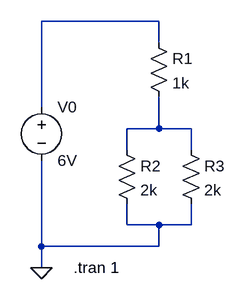
[diagram p0: schematic example_to_explain_V_and_I_measurements.asc]
example_to_explain_V_and_I_measurements.asc, the LTspice schematic file:
Version 4
SHEET 1 880 680
WIRE 432 48 256 48
WIRE 432 80 432 48
WIRE 256 176 256 48
WIRE 432 208 432 160
WIRE 432 208 384 208
WIRE 480 208 432 208
WIRE 384 240 384 208
WIRE 480 240 480 208
WIRE 384 352 384 320
WIRE 432 352 384 352
WIRE 480 352 480 320
WIRE 480 352 432 352
WIRE 256 384 256 256
WIRE 432 384 432 352
WIRE 432 384 256 384
WIRE 256 416 256 384
FLAG 256 416 0
SYMBOL res 416 64 R0
SYMATTR InstName R1
SYMATTR Value 1k
SYMBOL res 368 224 R0
SYMATTR InstName R2
SYMATTR Value 2k
SYMBOL res 464 224 R0
SYMATTR InstName R3
SYMATTR Value 2k
SYMBOL voltage 256 160 R0
WINDOW 123 0 0 Left 0
WINDOW 39 0 0 Left 0
SYMATTR InstName V0
SYMATTR Value 6V
TEXT 304 416 Left 2 !.tran 1

The netlist it stands for:
* example_to_explain_V_and_I_measurements.asc
R1 N001 N002 1k
R2 N002 0 2k
R3 N002 0 2k
V0 N001 0 6V
.tran 1
.backanno
.end